# EAGLE design SimpleTrigger (EAGLE 6.5.0)
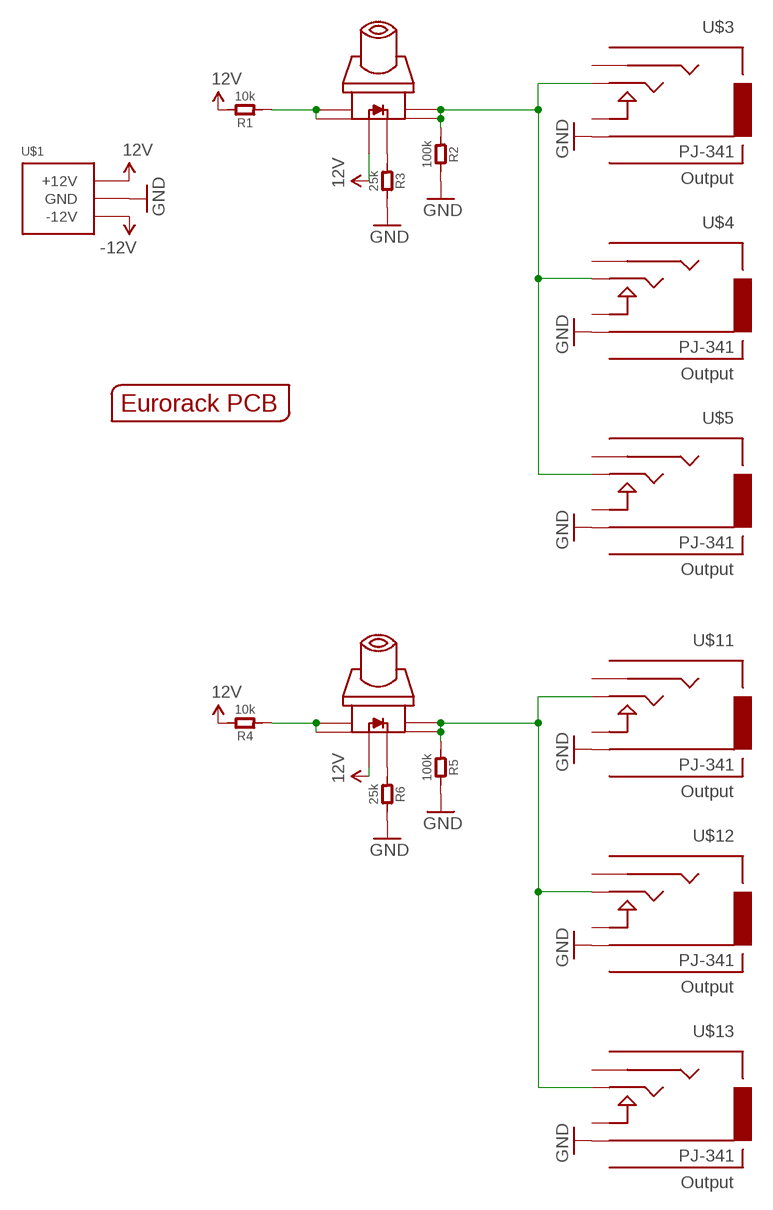
[diagram p0: schematic, sheet 1]

## Parts
R1  10k  R-0603  [R0603]
R2  100k  R-0603  [R0603]
R3  25k  R-0603  [R0603]
R4  10k  R-0603  [R0603]
R5  100k  R-0603  [R0603]
R6  25k  R-0603  [R0603]
U$1  POWER_SIMPLE10  [POWER_10]
U$2  SWITCH_W_LED_PB6149L-X-102WHITE  [PB6149L]
U$3  PJ-341  AUDIO-JACKOUTPUT  [3.5MM-JACK-SWITCH-13MM-OUTPUT]
U$4  PJ-341  AUDIO-JACKOUTPUT  [3.5MM-JACK-SWITCH-13MM-OUTPUT]
U$5  PJ-341  AUDIO-JACKOUTPUT  [3.5MM-JACK-SWITCH-13MM-OUTPUT]
U$9  EURORACK_PCB2HP  [EURORACK2HPPCB]
U$10  SWITCH_W_LED_PB6149L-X-102WHITE  [PB6149L]
U$11  PJ-341  AUDIO-JACKOUTPUT  [3.5MM-JACK-SWITCH-13MM-OUTPUT]
U$12  PJ-341  AUDIO-JACKOUTPUT  [3.5MM-JACK-SWITCH-13MM-OUTPUT]
U$13  PJ-341  AUDIO-JACKOUTPUT  [3.5MM-JACK-SWITCH-13MM-OUTPUT]

## Nets
12V: R1.2 R4.2 U$1.9(+12V) U$1.10(+12V) U$2.LEDPOS(POS) U$10.LEDPOS(POS)
-12V: U$1.1(-12V) U$1.2(-12V)
GND: R2.2 R3.2 R5.2 R6.2 U$1.3(GND) U$1.4(GND) U$1.5(GND) U$1.6(GND) U$1.7(GND) U$1.8(GND) U$3.RING@1(RING) U$3.RING@2(RING) U$4.RING@1(RING) U$4.RING@2(RING) U$5.RING@1(RING) U$5.RING@2(RING) U$11.RING@1(RING) U$11.RING@2(RING) U$12.RING@1(RING) U$12.RING@2(RING) U$13.RING@1(RING) U$13.RING@2(RING)
N$1: R3.1 U$2.LEDNEG(NEG)
N$2: R1.1 U$2.1 U$2.2
N$3: R2.1 U$2.3 U$2.4 U$3.TIP@1(TIP) U$3.TIP@2(TIP) U$4.TIP@1(TIP) U$4.TIP@2(TIP) U$5.TIP@1(TIP) U$5.TIP@2(TIP)
N$4: R6.1 U$10.LEDNEG(NEG)
N$5: R4.1 U$10.1 U$10.2
N$6: R5.1 U$10.3 U$10.4 U$11.TIP@1(TIP) U$11.TIP@2(TIP) U$12.TIP@1(TIP) U$12.TIP@2(TIP) U$13.TIP@1(TIP) U$13.TIP@2(TIP)
Unconnected: U$3.SECOND@1(SECOND) U$3.SECOND@2(SECOND) U$3.SWITCH@1(SWITCH) U$3.SWITCH@2(SWITCH) U$4.SECOND@1(SECOND) U$4.SECOND@2(SECOND) U$4.SWITCH@1(SWITCH) U$4.SWITCH@2(SWITCH) U$5.SECOND@1(SECOND) U$5.SECOND@2(SECOND) U$5.SWITCH@1(SWITCH) U$5.SWITCH@2(SWITCH) U$11.SECOND@1(SECOND) U$11.SECOND@2(SECOND) U$11.SWITCH@1(SWITCH) U$11.SWITCH@2(SWITCH) U$12.SECOND@1(SECOND) U$12.SECOND@2(SECOND) U$12.SWITCH@1(SWITCH) U$12.SWITCH@2(SWITCH) U$13.SECOND@1(SECOND) U$13.SECOND@2(SECOND) U$13.SWITCH@1(SWITCH) U$13.SWITCH@2(SWITCH)

## Library data of the parts
R1-R6 = OPL:R*
U$1 = EurorackModularParts:POWER_SIMPLE
U$2 U$10 = zephod-components:SWITCH_W_LED_PB6149L-X-102
U$3-U$5 U$11-U$13 = EurorackModularParts:AUDIO-JACK: Switching Mono 3.5mm Audio Jack from Erthenvar.; DESC: Output; MPN: PJ-341
U$9 = EurorackModularParts:EURORACK_PCB

## Board
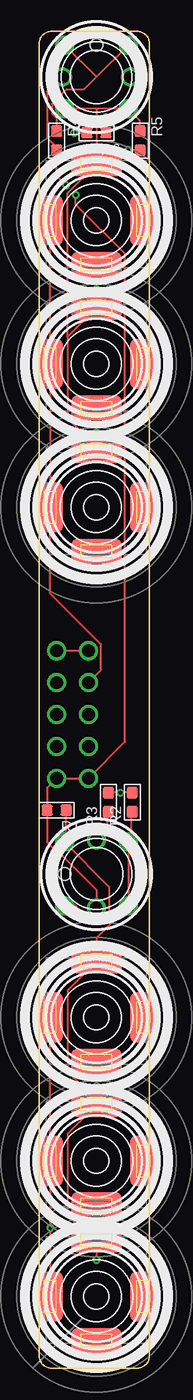
[diagram p1: board, top side]
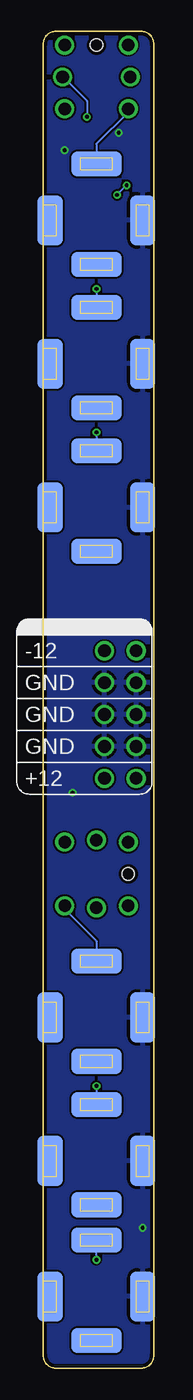
[diagram p2: board, bottom side, seen from below]

Size 8.82 x 106.5 mm. Coordinates in mm from the lower left corner, seen from the top.
Copper layers (1*16): Top 0.035mm / dielectric 1.5mm / Bottom 0.035mm
Design rules "ITEADstudio_DRC": minimum track width 6mil, minimum drill 12mil, track to track 6mil, track to pad 6mil, pad to pad 6mil, via to via 6mil, smd to smd 0mil, copper to edge 10mil, drill to drill 10mil, minimum pad ring 10mil, minimum via ring 6mil, stop-mask expansion 2mil, vias tented up to drill 100mil, thermal gap 10mil

### Footprints (pad centres in the part's own frame; a part is rotated, then mirrored left to right if it is on the bottom)
R0603 = smd 0.889 x 0.889: 1 -0.762,0; 2 0.762,0
POWER_10 = drill 1.016: 1 -5.08,-1.27; 2 -5.08,1.27; 3 -2.54,-1.27; 4 -2.54,1.27; 5 0,-1.27; 6 0,1.27; 7 2.54,-1.27; 8 2.54,1.27; 9 5.08,-1.27; 10 5.08,1.27
PB6149L = drill 1: 1 2.54,2.54; 2 2.54,-2.54; 3 -2.54,2.54; 4 -2.54,-2.54; LEDNEG 0,-2.7; LEDPOS 0,2.7 | hole 1: 2.54,0
3.5MM-JACK-SWITCH-13MM-OUTPUT = smd 2 x 4: RING@1 -3.7,0; SWITCH@1 3.7,0 | smd 2 x 4 bottom: RING@2 -3.7,0; SWITCH@2 3.7,0 | smd 4 x 2: SECOND@1 0,-3.5; TIP@1 0,4.5 | smd 4 x 2 bottom: SECOND@2 0,-3.5; TIP@2 0,4.5

### Placement (x,y rotation side)
R1  1.41,44.45 180 top
R2  7.44,45.09 90 top
R3  5.53,45.09 90 top
R4  1.41,97.79 270 top
R5  8.07,97.79 270 top
R6  4.58,98.42 180 top
U$1  2.67,52.07 270 bottom
U$2  4.58,39.37 180 top
U$3  4.58,16.51 0 top
U$4  4.58,5.71 0 top
U$5  4.58,27.94 0 top
U$9  -0.5,0 0 top
U$10  4.58,102.87 90 top
U$11  4.58,68.58 0 top
U$12  4.58,80.01 0 top
U$13  4.58,91.44 0 top

### Tracks (layer width: path | path; a pad name or v marks a point on that pad's centre or on a via)
12V  (via drill 0.3)
  Top 0.152: U$10.LEDPOS 1.79,102.87 0.64,101.73 0.64,98.04 1.41,97.28 R4.2 1.41,95 v2.17,94.23 | U$2.LEDPOS 4.58,38.1 1.79,40.89 1.66,40.89 0.64,41.91 R1.2 0.64,46.23 U$1.10 U$1.9 6.87,49.91 6.87,88.77 2.93,92.71 v2.93,93.47
  Bottom 0.152: v2.93,93.47 v2.17,94.23
-12V
  Top 0.152: U$1.1 U$1.2
GND  (via drill 0.3)
  Top 0.152: 0.9,80.01 0.9,68.58 | 0.9,80.01 0.9,91.44 U$13.RING@2 | 0.9,80.01 U$12.RING@2 | 0.9,16.51 v0.9,11.18 0.9,5.71 U$4.RING@2 | 0.9,16.51 0.9,27.94 U$5.RING@2 | 0.9,16.51 U$3.RING@2 | R2.2 v6.49,45.85 R3.2 | v2.8,98.42 R6.2 | v7.12,97.03 R5.2 | 0.9,68.58 0.9,61.72 4.96,57.66 4.96,55.63 U$1.3 | 0.9,68.58 U$11.RING@2
  pour Bottom: -3.04,109.22 22.36,109.22 22.36,-5.08 -3.04,-5.08
N$1
  Top 0.152: R3.1 5.47,44.32 5.47,43.05 4.58,42.16 U$2.LEDNEG
N$2
  Top 0.152: R1.1 2.17,42.04 U$2.2 5.6,38.35 5.6,36.2 5.09,35.69 4.07,35.69 2.93,36.83 U$2.1
N$3  (via drill 0.3)
  Top 0.152: v4.58,8.64 U$4.TIP@2 4.58,10.29 4.2,10.29 2.29,12.19 2.29,18.67 4.58,20.95 U$3.TIP@2 v4.58,22.48 3.44,22.48 2.29,23.62 2.29,30.1 4.58,32.38 U$5.TIP@2 4.58,34.29 U$2.3 U$2.4 7.37,42.16 7.37,44.32 R2.1
  Bottom 0.152: v4.58,8.64 U$4.TIP@2 | v4.58,22.48 U$3.TIP@2 | U$5.TIP@2 4.58,34.04 7.12,36.58 U$2.3
N$4  (via drill 0.3)
  Top 0.152: v5.34,99.69 R6.1
  Bottom 0.152: v5.34,99.69 5.34,100.97 7.25,102.87 U$10.LEDNEG
N$5
  Top 0.152: R4.1 1.41,99.57 1.02,99.95 1.02,100.71 2.17,101.85 3.56,101.85 4.58,102.87 | U$10.2 4.58,102.87 | 4.58,102.87 U$10.1
N$6  (via drill 0.3)
  Top 0.152: R5.1 8.01,98.55 8.01,99.44 U$10.4 4.58,100.33 | 4.58,100.33 U$10.3 | 4.58,100.33 U$13.TIP@1 4.58,95.89 2.29,93.6 2.29,82.17 | U$11.TIP@1 v4.58,74.55 3.44,74.55 2.29,75.69 2.29,82.17 | 2.29,82.17 4.58,84.45 U$12.TIP@1 v4.58,85.98
  Bottom 0.152: U$13.TIP@1 4.58,97.54 2.04,100.08 U$10.3 | v4.58,74.55 U$11.TIP@1 | v4.58,85.98 U$12.TIP@1